# EAGLE design NQSMHS (EAGLE 5.10)

## Sheet 1 of 4
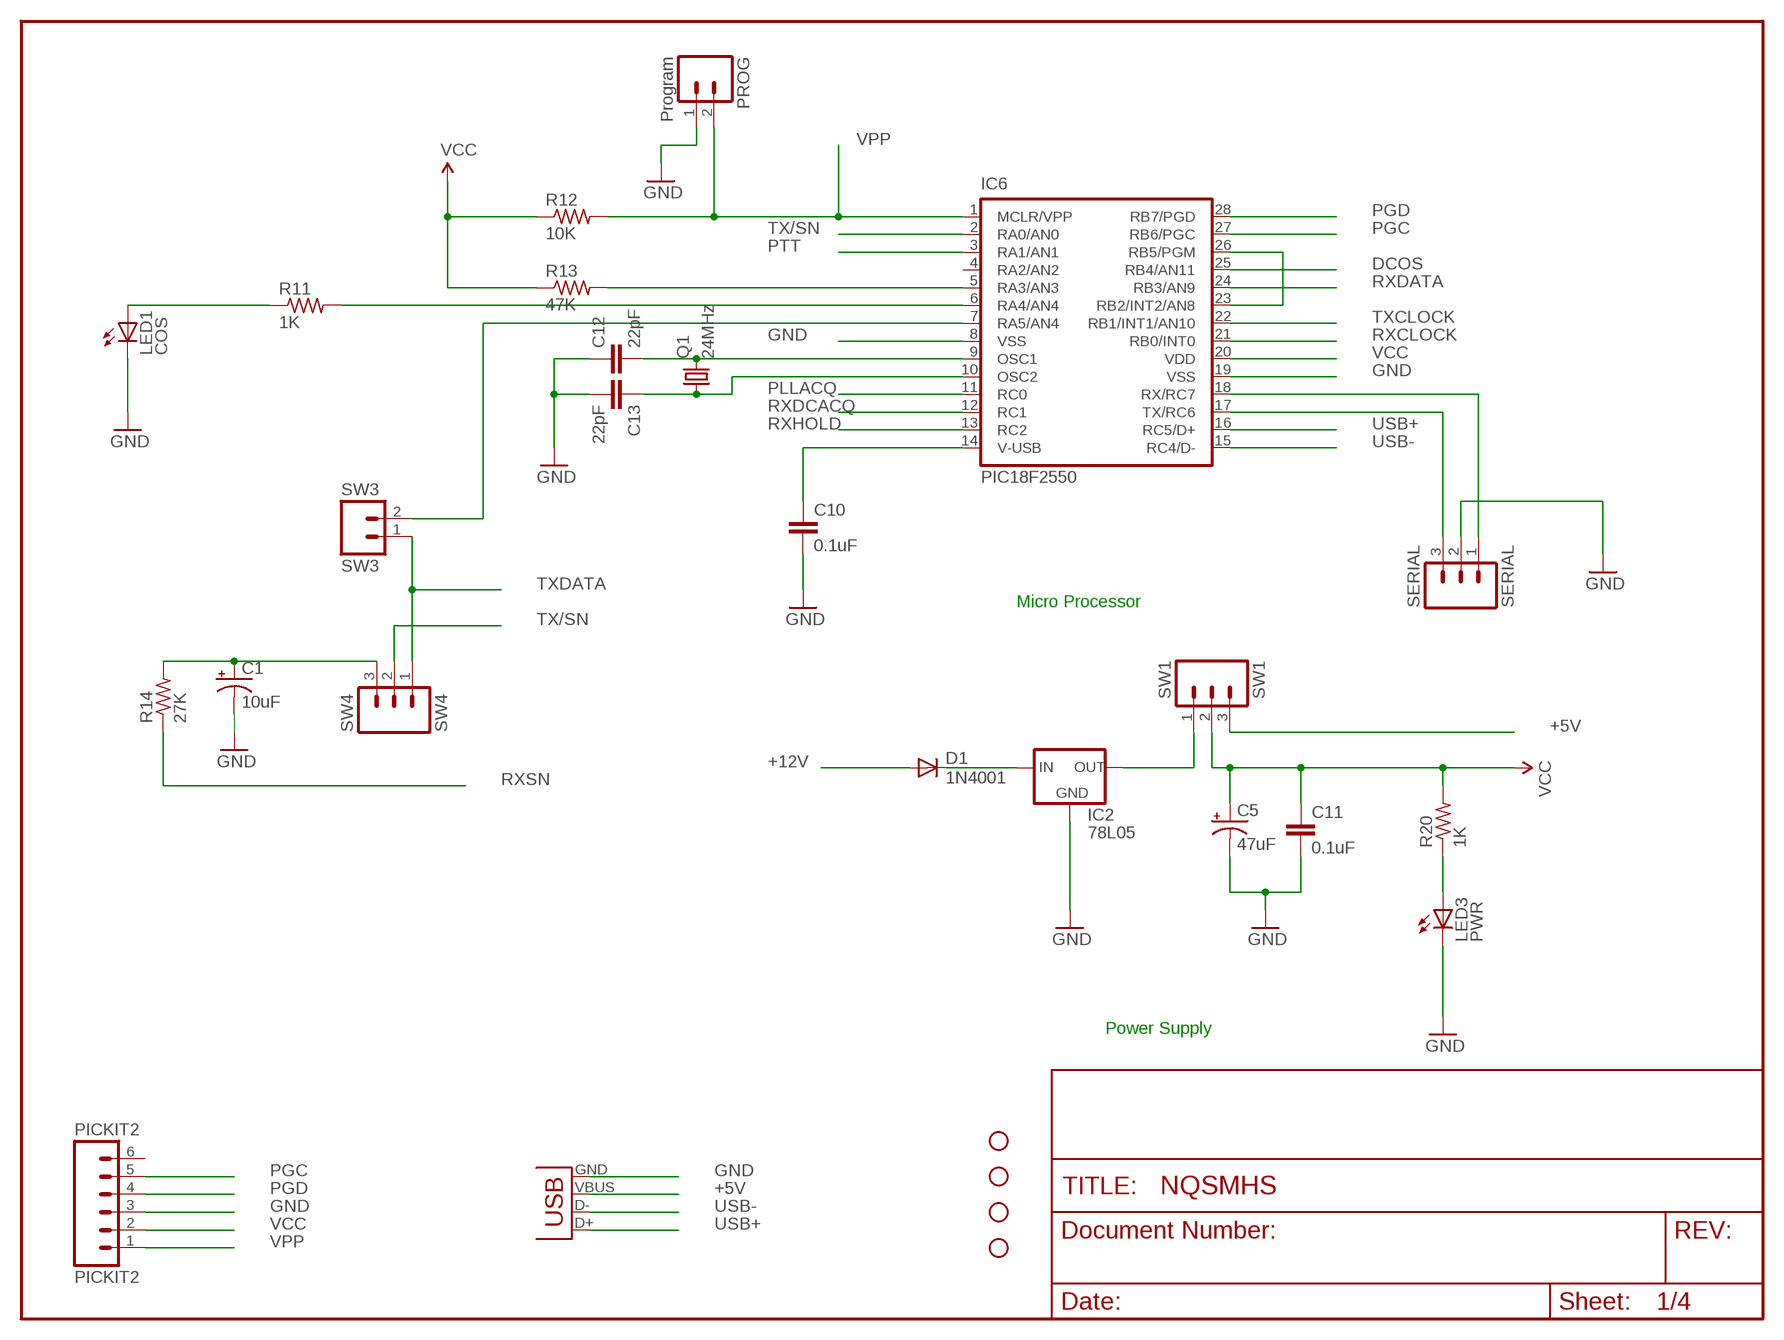
[diagram p0: schematic, sheet 1]

### Parts
C1  10uF  CAP_POLPTH2  [CPOL-RADIAL-10UF-25V]
C5  47uF  CAP_POLPTH2  [CPOL-RADIAL-10UF-25V]
C10  0.1uF  C2.5/2  [C2.5-2]
C11  0.1uF  C2.5/2  [C2.5-2]
C12  22pF  C2.5/2  [C2.5-2]
C13  22pF  C2.5/2  [C2.5-2]
D1  1N4001  DIODEPTH  [DIODE-1N4001]
IC2  78L05  78LXX  [78LXX]
IC6  PIC18F2550  [DIL28-3]
J1  USBPTH  [USB-B-PTH]
JP7  STAND-OFF  [STAND-OFF]
JP8  STAND-OFF  [STAND-OFF]
JP9  STAND-OFF  [STAND-OFF]
JP10  STAND-OFF  [STAND-OFF]
LED1  COS  LED5MM  [LED5MM]
LED3  PWR  LED5MM  [LED5MM]
PICKIT2  PICKIT2  M06SIP  [1X06]
PROG  Program  M02PTH  [1X02]
Q1  24MHz  CRYSTALHC49US  [HC49US]
R11  1K  R-US_0207/2V  [0207/2V]
R12  10K  R-US_0207/2V  [0207/2V]
R13  47K  R-US_0207/2V  [0207/2V]
R14  27K  R-US_0207/2V  [0207/2V]
R20  1K  R-US_0207/2V  [0207/2V]
SERIAL  SERIAL  M03PTH  [1X03]
SW1  SW1  M03PTH  [1X03]
SW3  SW3  M02PTH  [1X02]
SW4  SW4  M03PTH  [1X03]

### Nets
+5V: J1.VBUS SW1.3
+12V: D1.A ; also sheet 2
DCOS: IC6.25(RB4/AN11) ; also sheet 3
GND: C1.2(-) C5.2(-) C10.2 C11.2 C12.1 C13.2 IC2.GND IC6.8(VSS) IC6.19(VSS) J1.GND LED1.K(C) LED3.K(C) PICKIT2.3 PROG.1 SERIAL.2 ; also sheet 2,3,4
N$2: D1.C IC2.IN
N$3: IC6.23(RB2/INT2/AN8) IC6.26(RB5/PGM)
N$4: IC6.5(RA3/AN3) R13.2
N$5: IC6.6(RA4/AN4) R11.2
N$6: LED1.A R11.1
N$7: IC6.7(RA5/AN4) SW3.2
N$8: C1.1(+) R14.2 SW4.3
N$9: C12.2 IC6.9(OSC1) Q1.2
N$10: C13.1 IC6.10(OSC2) Q1.1
N$11: C10.1 IC6.14(V-USB)
N$12: IC2.OUT SW1.1
N$13: LED3.A R20.1
PGC: IC6.27(RB6/PGC) PICKIT2.5
PGD: IC6.28(RB7/PGD) PICKIT2.4
PLLACQ: IC6.11(RC0) ; also sheet 4
PTT: IC6.3(RA1/AN1) ; also sheet 2
RX-232: IC6.18(RX/RC7) SERIAL.1
RXCLOCK: IC6.21(RB0/INT0) ; also sheet 4
RXDATA: IC6.24(RB3/AN9) ; also sheet 4
RXDCACQ: IC6.12(RC1) ; also sheet 4
RXHOLD: IC6.13(RC2) ; also sheet 4
RXSN: R14.1 ; also sheet 3,4
TX-232: IC6.17(TX/RC6) SERIAL.3
TX/SN: IC6.2(RA0/AN0) SW4.2
TXCLOCK: IC6.22(RB1/INT1/AN10) ; also sheet 4
TXDATA: SW3.1 SW4.1 ; also sheet 4
USB+: IC6.16(RC5/D+) J1.D+
USB-: IC6.15(RC4/D-) J1.D-
VCC: C5.1(+) C11.1 IC6.20(VDD) PICKIT2.2 R12.1 R13.1 R20.2 SW1.2 ; also sheet 2,3,4
VPP: IC6.1(MCLR/VPP) PICKIT2.1 PROG.2 R12.2
Unconnected: IC6.4(RA2/AN2) PICKIT2.6

### Notes on the sheet
- Micro Processor
- Power Supply

## Sheet 2 of 4
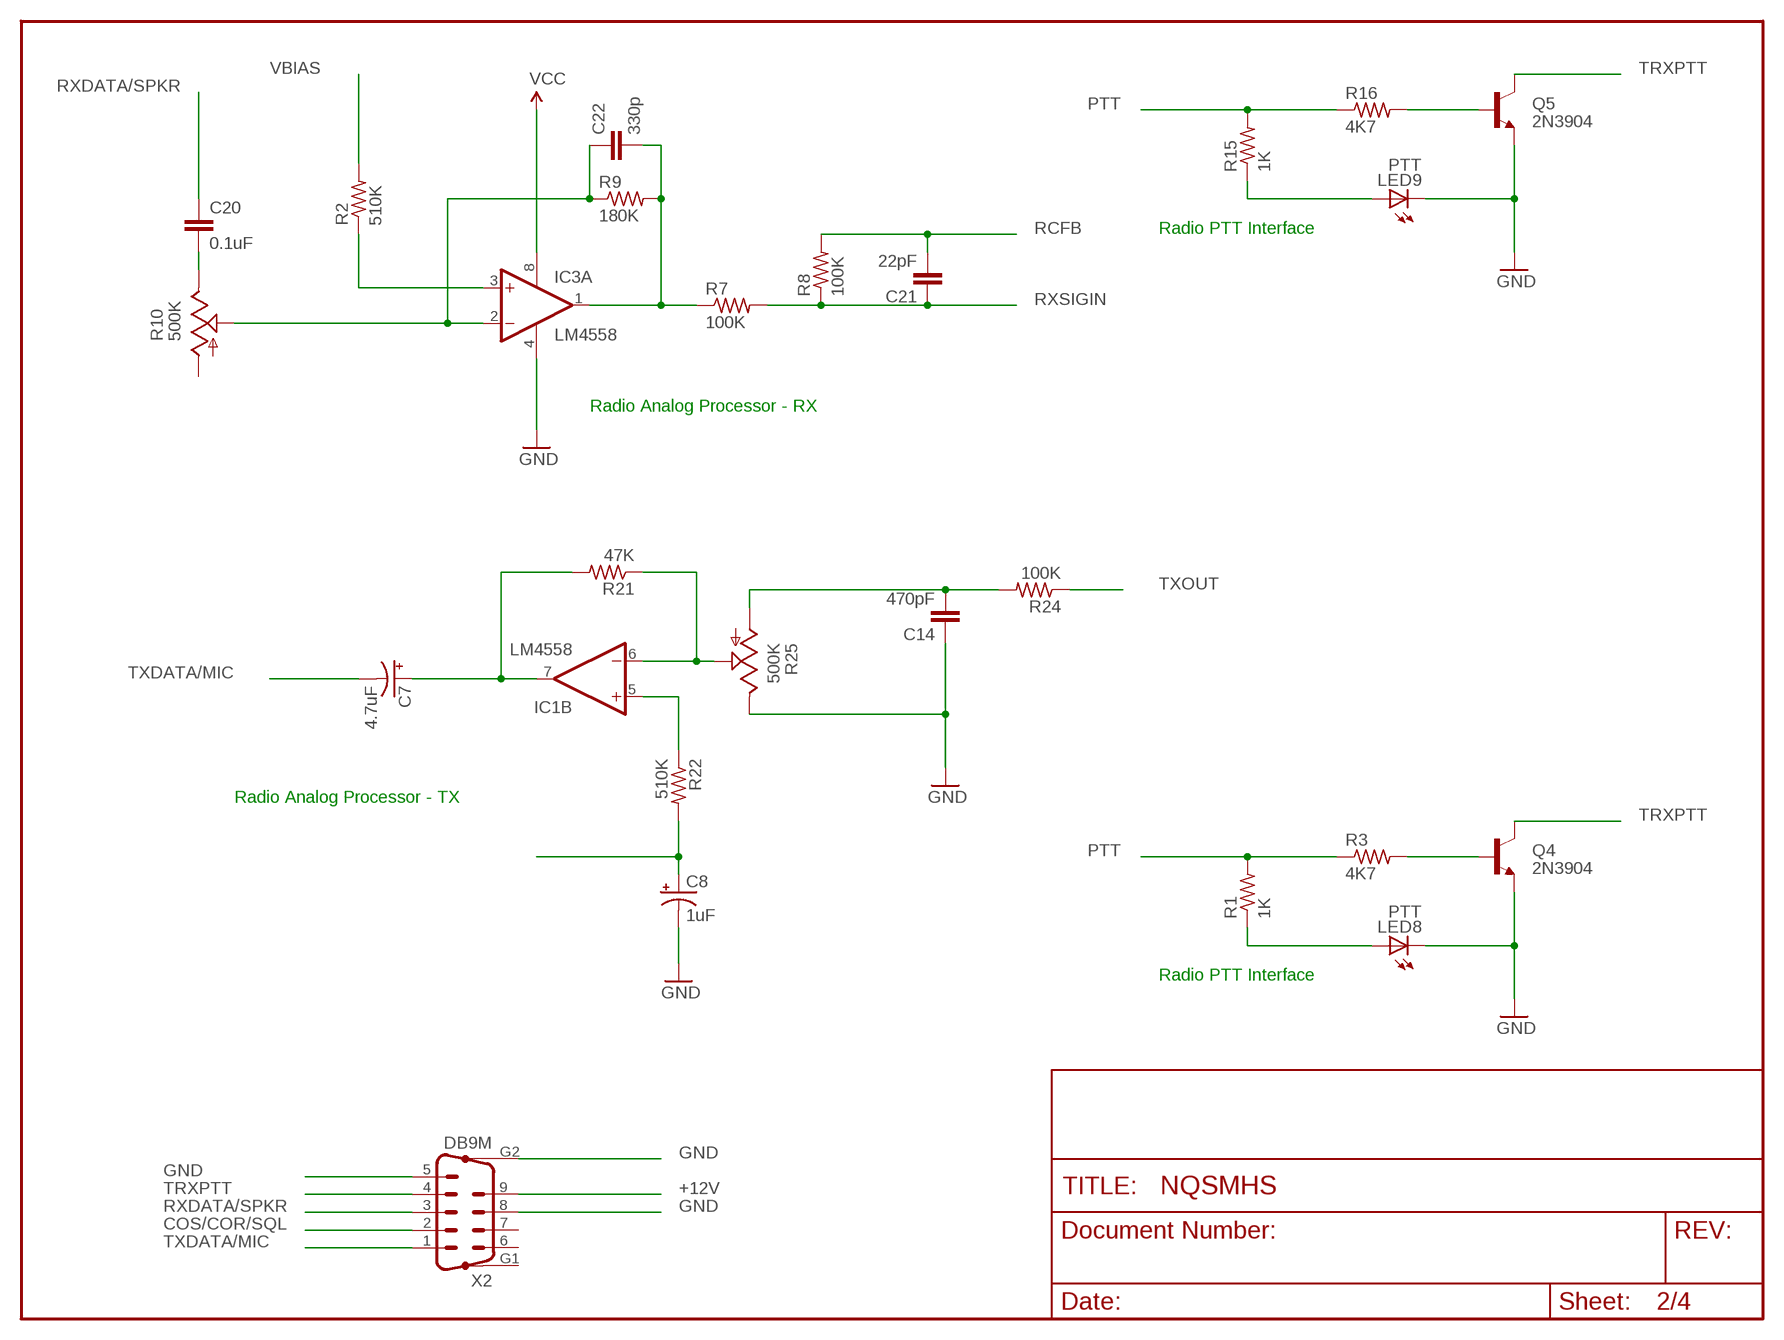
[diagram p1: schematic, sheet 2]

### Parts
C7  4.7uF  CAP_POLPTH2  [CPOL-RADIAL-10UF-25V]
C8  1uF  CAP_POLPTH2  [CPOL-RADIAL-10UF-25V]
C14  470pF  C2.5/2  [C2.5-2]
C20  0.1uF  C2.5/2  [C2.5-2]
C21  22pF  C2.5/2  [C2.5-2]
C22  330p  C2.5/2  [C2.5-2]
IC1  LM4558  OPA2344P  [DIL08]
IC3  LM4558  OPA2344P  [DIL08]
LED8  PTT  LED5MM  [LED5MM]
LED9  PTT  LED5MM  [LED5MM]
Q4  2N3904  TRANSISTOR_NPNTO92  [TO-92]
Q5  2N3904  TRANSISTOR_NPNTO92  [TO-92]
R1  1K  R-US_0207/2V  [0207/2V]
R2  510K  R-US_0207/2V  [0207/2V]
R3  4K7  R-US_0207/2V  [0207/2V]
R7  100K  R-US_0207/2V  [0207/2V]
R8  100K  R-US_0207/2V  [0207/2V]
R9  180K  R-US_0207/2V  [0207/2V]
R10  500K  TRIM_US-CA6V  [CA6V]
R15  1K  R-US_0207/2V  [0207/2V]
R16  4K7  R-US_0207/2V  [0207/2V]
R21  47K  R-US_0207/2V  [0207/2V]
R22  510K  R-US_0207/2V  [0207/2V]
R24  100K  R-US_0207/2V  [0207/2V]
R25  500K  TRIM_US-CA6V  [CA6V]
X2  DB9M  M09HP  [M09HP]

### Nets
+12V: X2.9 ; also sheet 1
COS/COR/SQL: X2.2
GND: C8.2(-) C14.1 IC3.4(A:V-) LED8.K(C) LED9.K(C) Q4.1(E) Q5.1(E) R25.E X2.5 X2.8 X2.G2 ; also sheet 1,3,4
N$15: Q4.2(B) R3.2
N$17: LED8.A R1.1
N$18: Q5.2(B) R16.2
N$19: C7.1(+) IC1.7(B:OUT) R21.2
N$20: LED9.A R15.1
N$23: C22.2 IC3.1(A:OUT) R7.1 R9.2
N$25: IC1.5(B:+IN) R22.1
N$26: C22.1 IC3.2(A:-IN) R9.1 R10.S
N$27: C14.2 R24.2 R25.A
N$28: IC1.6(B:-IN) R21.1 R25.S
N$37: C20.2 R10.E
N$40: IC3.3(A:+IN) R2.1
PTT: R1.2 R3.1 R15.2 R16.1 ; also sheet 1
RCFB: C21.2 R8.2 ; also sheet 4
RXDATA/SPKR: C20.1 X2.3
RXSIGIN: C21.1 R7.2 R8.1 ; also sheet 4
TRXPTT: Q4.3(C) Q5.3(C) X2.4
TXDATA/MIC: C7.2(-) X2.1
TXOUT: R24.1 ; also sheet 4
VBIAS: C8.1(+) R2.2 R22.2 ; also sheet 4
VCC: IC3.8(A:V+) ; also sheet 1,3,4
Unconnected: IC1.1(A:OUT) IC1.2(A:-IN) IC1.3(A:+IN) IC3.5(B:+IN) IC3.6(B:-IN) IC3.7(B:OUT) R10.A X2.6 X2.7 X2.G1

### Notes on the sheet
- Radio PTT Interface
- Radio Analog Processor - RX
- Radio Analog Processor - TX
- Radio PTT Interface

## Sheet 3 of 4
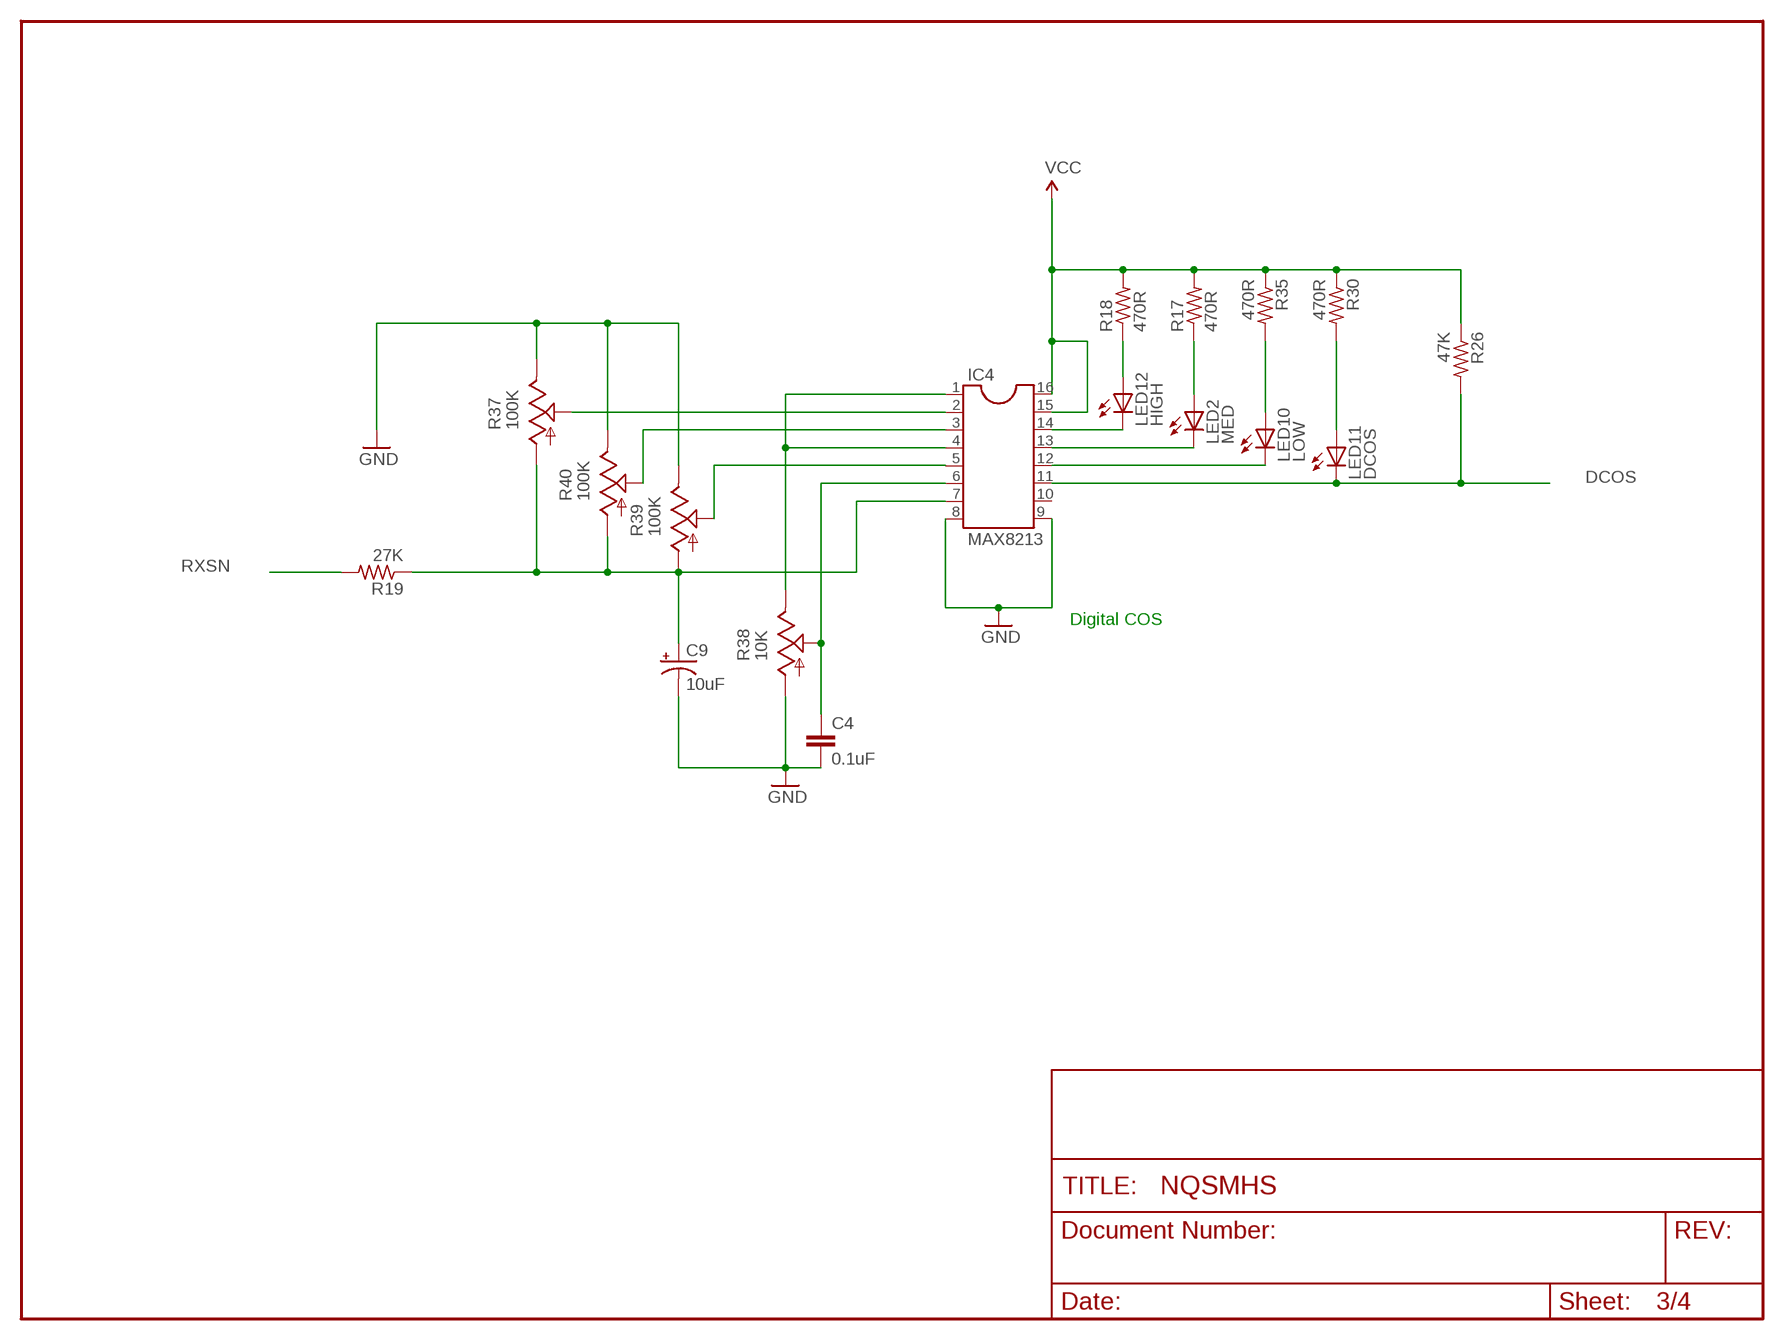
[diagram p2: schematic, sheet 3]

### Parts
C4  0.1uF  C2.5/2  [C2.5-2]
C9  10uF  CAP_POLPTH2  [CPOL-RADIAL-10UF-25V]
IC4  MAX8213  DIL16  [DIL16]
LED2  MED  LED5MM  [LED5MM]
LED10  LOW  LED5MM  [LED5MM]
LED11  DCOS  LED5MM  [LED5MM]
LED12  HIGH  LED5MM  [LED5MM]
R17  470R  R-US_0207/2V  [0207/2V]
R18  470R  R-US_0207/2V  [0207/2V]
R19  27K  R-US_0207/2V  [0207/2V]
R26  47K  R-US_0207/2V  [0207/2V]
R30  470R  R-US_0207/2V  [0207/2V]
R35  470R  R-US_0207/2V  [0207/2V]
R37  100K  TRIM_US-CA6V  [CA6V]
R38  10K  TRIM_US-CA6V  [CA6V]
R39  100K  TRIM_US-CA6V  [CA6V]
R40  100K  TRIM_US-CA6V  [CA6V]

### Nets
DCOS: IC4.11 LED11.K(C) R26.2 ; also sheet 1
GND: C4.2 C9.2(-) IC4.8 IC4.9 R37.E R38.A R39.E R40.E ; also sheet 1,2,4
N$14: C4.1 IC4.6 R38.S
N$16: IC4.14 LED12.K(C)
N$41: LED12.A R18.1
N$44: IC4.13 LED2.K(C)
N$45: LED2.A R17.1
N$46: IC4.12 LED10.K(C)
N$47: LED11.A R30.2
N$48: LED10.A R35.2
N$49: IC4.2 R37.S
N$50: IC4.3 R40.S
N$51: IC4.5 R39.S
N$52: IC4.1 IC4.4 R38.E
N$53: C9.1(+) IC4.7 R19.1 R37.A R39.A R40.A
RXSN: R19.2 ; also sheet 1,4
VCC: IC4.15 IC4.16 R17.2 R18.2 R26.1 R30.1 R35.1 ; also sheet 1,2,4
Unconnected: IC4.10

### Notes on the sheet
- Digital COS

## Sheet 4 of 4
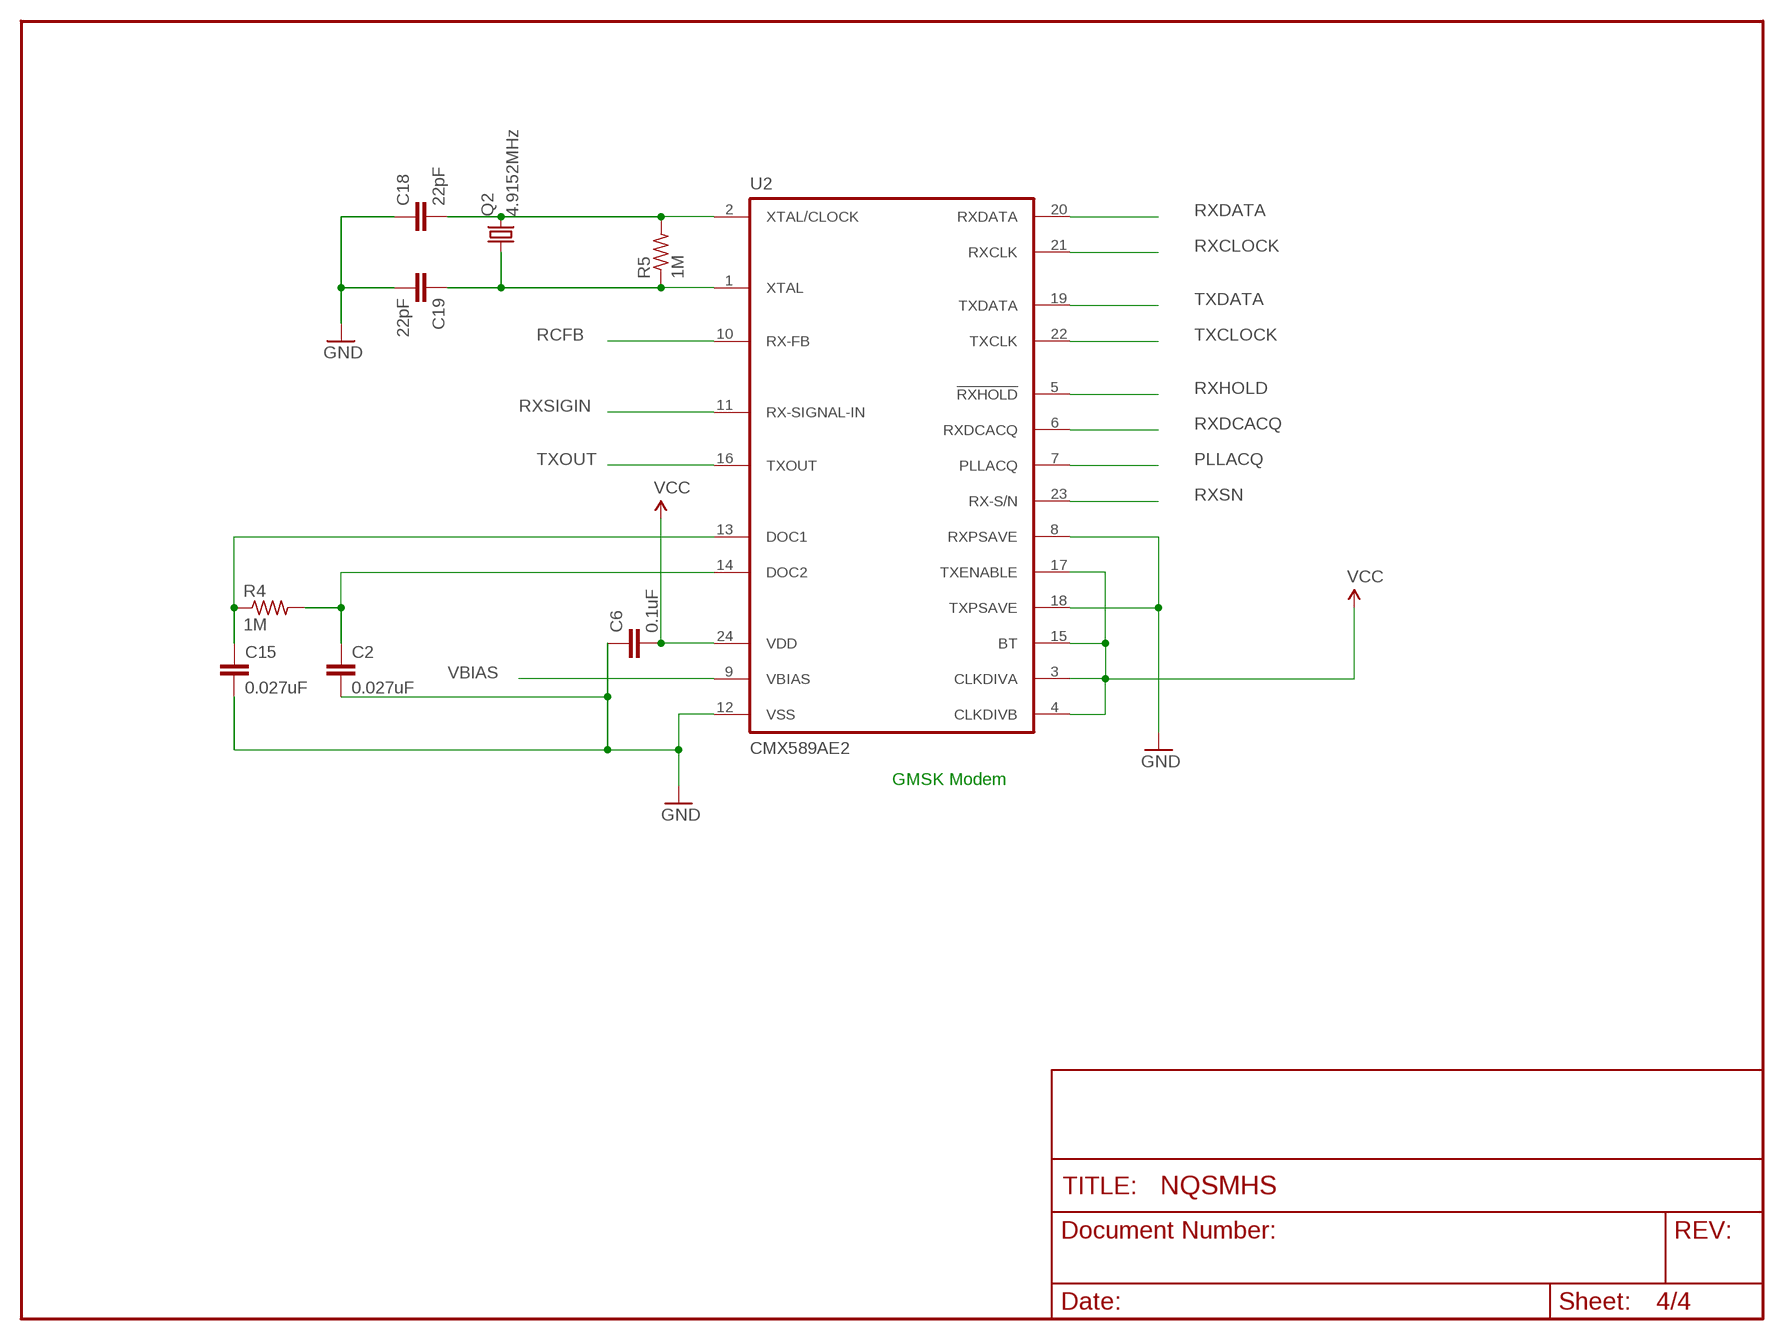
[diagram p3: schematic, sheet 4]

### Parts
C2  0.027uF  C2.5/2  [C2.5-2]
C6  0.1uF  C2.5/2  [C2.5-2]
C15  0.027uF  C2.5/2  [C2.5-2]
C18  22pF  C2.5/2  [C2.5-2]
C19  22pF  C2.5/2  [C2.5-2]
Q2  4.9152MHz  CRYSTALHC49US  [HC49US]
R4  1M  R-US_0207/2V  [0207/2V]
R5  1M  R-US_0207/2V  [0207/2V]
U2  CMX589AE2  [TSSOP24]

### Nets
GND: C2.2 C6.1 C15.2 C18.1 C19.2 U2.8(RXPSAVE) U2.12(VSS) U2.18(TXPSAVE) ; also sheet 1,2,3
N$1: C15.1 R4.1 U2.13(DOC1)
N$21: C2.1 R4.2 U2.14(DOC2)
N$22: C19.1 Q2.1 R5.1 U2.1(XTAL)
N$24: C18.2 Q2.2 R5.2 U2.2(XTAL/CLOCK)
PLLACQ: U2.7(PLLACQ) ; also sheet 1
RCFB: U2.10(RX-FB) ; also sheet 2
RXCLOCK: U2.21(RXCLK) ; also sheet 1
RXDATA: U2.20(RXDATA) ; also sheet 1
RXDCACQ: U2.6(RXDCACQ) ; also sheet 1
RXHOLD: U2.5(!RXHOLD!) ; also sheet 1
RXSIGIN: U2.11(RX-SIGNAL-IN) ; also sheet 2
RXSN: U2.23(RX-S/N) ; also sheet 1,3
TXCLOCK: U2.22(TXCLK) ; also sheet 1
TXDATA: U2.19(TXDATA) ; also sheet 1
TXOUT: U2.16(TXOUT) ; also sheet 2
VBIAS: U2.9(VBIAS) ; also sheet 2
VCC: C6.2 U2.3(CLKDIVA) U2.4(CLKDIVB) U2.15(BT) U2.17(TXENABLE) U2.24(VDD) ; also sheet 1,2,3

### Notes on the sheet
- GMSK Modem

## Power pins joined to a net without a drawn wire
V+: IC1.8(A:V+)
V-: IC1.4(A:V-)

## Library data of the parts
C1 C5 C7-C9 = SparkFun:CAP_POL: Capacitor Polarized These are standard SMD and PTH capacitors. Normally 10uF, 47uF, and 100uF in electrolytic and tantalum varieties. Always verify the external diameter of the through hole cap, it varies with capacity, voltage, and manufacturer. The EIA devices should be standard.
C2 C4 C6 C10-C15 C18-C22 = capacitor-wima:C: CAPACITOR naming: grid - package width
D1 = SparkFun:DIODE: Diode These are standard reverse protection diodes and small signal diodes. SMA package can handle up to about 1A. SOD-323 can handle about 200mA. What the SOD-323 package when ordering, there are some mfgs out there that are 5-pin packages.
IC1 IC3 = linear:OPA2*: Dual Operational Amplifier Low Power, Single-Supply, Rail-To-Rail Operational Amplifier Source: http://focus.ti.com/lit/ds/symlink/opa2345.pdf http://focus.ti.com .. opa241.pdf http://focus.ti.com/lit/ds/symlink/opa2134.pdf
IC2 = v-reg:78LXX: VOLTAGE REGULATOR
IC4 = ic-package:DIL16: Dual In Line / Socket
IC6 = SparkFun:PIC18F2550
J1 = SparkFun:USB: USB Connectors USB-B-PTH is fully proven SKU : PRT-00139 USB-miniB is fully proven SKU : PRT-00587 USB-A-PCB is untested. USB-A-H is throughly reviewed, but untested. Spark Fun Electronics SKU : PRT-00437 USB-B-SMT is throughly reviewed, but untested. Needs silkscreen touching up. USB-A-S has not been used/tested USB-MB-H has not been used/tested
JP7-JP10 = SparkFun:STAND-OFF: Stand Off This is the mechanical footprint for a #4 phillips button head screw. Use the keepout ring to avoid running the screw head into surrounding components. SKU : PRT-00447
LED1-LED3 LED8-LED12 = SparkFun:LED: LEDs Standard schematic elements and footprints for 5mm, 3mm, 1206, and 0603 sized LEDs. 5mm - Spark Fun Electronics SKU : COM-00529 (and others)
PICKIT2 = SparkFun:M06: Header 6 Standard 6-pin 0.1" header. Use with straight break away headers (SKU : PRT-00116), right angle break away headers (PRT-00553), swiss pins (PRT-00743), machine pins (PRT-00117), and female headers (PRT-00115). Molex polarized connector foot print use with SKU : PRT-08094 with associated crimp pins and housings. NOTES ON THE VARIANTS LOCK and LOCK_LONGPADS... This footprint was designed to help hold the alignment of a through-hole component (i.e. 6-pin header) while soldering it into place. You may notice that each hole has been shifted either up or down by 0.005 of an inch from it's more standard position (which is a perfectly straight line). This slight alteration caused the pins (the squares in the middle) to touch the edges of the holes. Because they are alternating, it causes a "brace" to hold the component in place. 0.005 has proven to be the perfect amount of "off-center" position when using our standard breakaway headers. Although looks a little odd when you look at the bare footprint, once you have a header in there, the alteration is very hard to notice. Also, if you push a header all the way into place, it is covered up entirely on the bottom side. This idea of altering the position of holes to aid alignment will be further integrated into the Sparkfun Library for other footprints. It can help hold any component with 3 or more connection pins.
PROG SW3 = SparkFun:M02: Header 2 Standard 2-pin 0.1" header. Use with straight break away headers (SKU : PRT-00116), right angle break away headers (PRT-00553), swiss pins (PRT-00743), machine pins (PRT-00117), and female headers (PRT-00115). Molex polarized connector foot print use with SKU : PRT-08233 with associated crimp pins and housings.
Q1 Q2 = SparkFun:CRYSTAL: Crystals Various standard crystals. Proven footprints. Spark Fun Electronics SKU : COM-00534
Q4 Q5 = SparkFun:TRANSISTOR_NPN: Transistor NPN BJT configuration in SOT23 package. MMBT2222 is the common NPN we use. Double check BCE configuration again layout.
R1-R5 R7-R9 R11-R22 R24 R26 R30 R35 = resistor:R-US_: RESISTOR, American symbol
R10 R25 R37-R40 = pot:TRIM_US-: POTENTIOMETER
SERIAL SW1 SW4 = SparkFun:M03: Header 3 Standard 3-pin 0.1" header. Use with straight break away headers (SKU : PRT-00116), right angle break away headers (PRT-00553), swiss pins (PRT-00743), machine pins (PRT-00117), and female headers (PRT-00115). Molex polarized connector foot print use with SKU : PRT-08232 with associated crimp pins and housings.
U2 = cml-micro:CMX589A: HIGH-SPEED GMSK MODEM
X2 = con-subd:M09HP: SUB-D

## Board
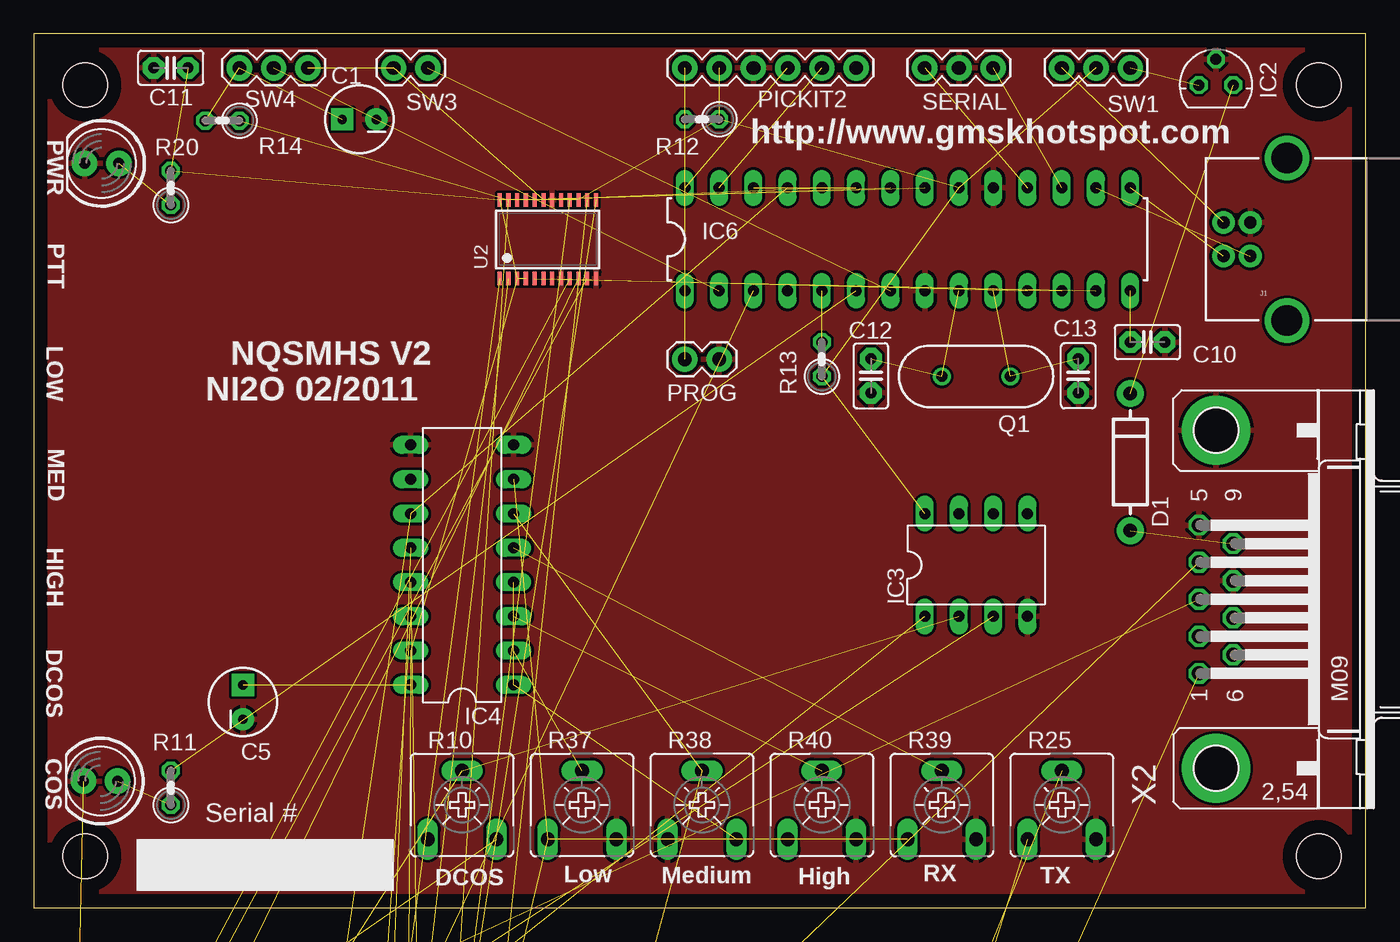
[diagram p4: board, top side]
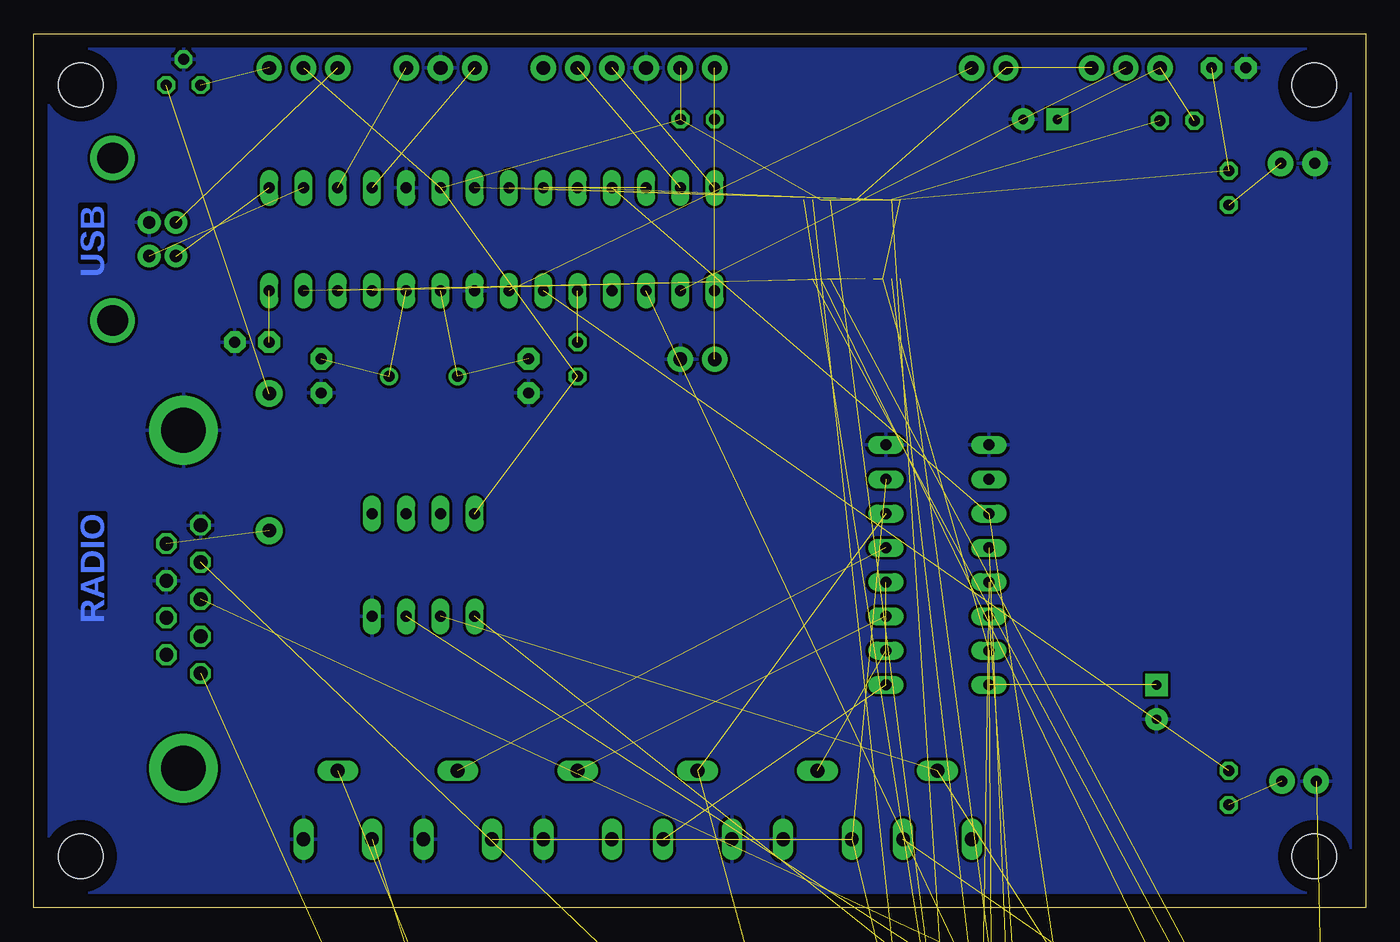
[diagram p5: board, bottom side, seen from below]

Size 98.73 x 64.76 mm. Coordinates in mm from the lower left corner, seen from the top.
Outline: 98.73,0 98.73,64.76 0,64.76 0,0 98.73,0
Copper layers (1*16): Top 0.035mm / dielectric 1.5mm / Bottom 0.035mm
Design rules "default": minimum track width 10mil, minimum drill 24mil, track to track 8mil, track to pad 8mil, pad to pad 8mil, via to via 8mil, smd to smd 8mil, copper to edge 40mil, drill to drill 8mil, minimum pad ring 10mil, minimum via ring 8mil, stop-mask expansion 4mil, vias tented up to drill 0mil, thermal gap 10mil

### Footprints (pad centres in the part's own frame; a part is rotated, then mirrored left to right if it is on the bottom)
CPOL-RADIAL-10UF-25V = drill 0.7 pad 1.651 square: 1 1.27,0 | drill 0.7 pad 1.651 round: 2 -1.27,0
C2.5-2 = drill 0.813 pad 1.6 octagon: 1 -1.27,0; 2 1.27,0
DIODE-1N4001 = drill 1 pad 1.981 round: A -5.08,0; C 5.08,0
DIL08 = drill 0.813 long: 1 -3.81,-3.81; 2 -1.27,-3.81; 3 1.27,-3.81; 4 3.81,-3.81; 5 3.81,3.81; 6 1.27,3.81; 7 -1.27,3.81; 8 -3.81,3.81
78LXX = drill 0.813 octagon: GND 0,1.905; IN 1.27,0; OUT -1.27,0
DIL16 = drill 0.813 long: 1 -8.89,-3.81; 2 -6.35,-3.81; 3 -3.81,-3.81; 4 -1.27,-3.81; 5 1.27,-3.81; 6 3.81,-3.81; 7 6.35,-3.81; 8 8.89,-3.81; 9 8.89,3.81; 10 6.35,3.81; 11 3.81,3.81; 12 1.27,3.81; 13 -1.27,3.81; 14 -3.81,3.81; 15 -6.35,3.81; 16 -8.89,3.81
DIL28-3 = drill 0.813 long: 1 -16.51,-3.81; 2 -13.97,-3.81; 3 -11.43,-3.81; 4 -8.89,-3.81; 5 -6.35,-3.81; 6 -3.81,-3.81; 7 -1.27,-3.81; 8 1.27,-3.81; 9 3.81,-3.81; 10 6.35,-3.81; 11 8.89,-3.81; 12 11.43,-3.81; 13 13.97,-3.81; 14 16.51,-3.81; 15 16.51,3.81; 16 13.97,3.81; 17 11.43,3.81; 18 8.89,3.81; 19 6.35,3.81; 20 3.81,3.81; 21 1.27,3.81; 22 -1.27,3.81; 23 -3.81,3.81; 24 -6.35,3.81; 25 -8.89,3.81; 26 -11.43,3.81; 27 -13.97,3.81; 28 -16.51,3.81
USB-B-PTH = drill 0.914 pad 1.676 round: D+ 0,1.25; D- 1.981,1.25; GND 0,-1.25; VBUS 1.981,-1.25 | drill 2.286 round: P$1 -2.718,-6.02; P$2 -2.718,6.02
STAND-OFF = hole 3.302: 0,0
LED5MM = drill 0.813 pad 1.88 round: A -1.27,0; K 1.27,0
1X06 = drill 1.016 pad 1.88 round: 1 0,0; 2 2.54,0; 3 5.08,0; 4 7.62,0; 5 10.16,0; 6 12.7,0
1X02 = drill 1.016 pad 1.88 round: 1 0,0; 2 2.54,0
HC49US = drill 0.813 round: 1 -2.54,0; 2 2.54,0
TO-92 = drill 0.813 pad 1.88 round: 1 -1.27,0; 2 0,1.905; 3 1.27,0
0207/2V = drill 0.813 octagon: 1 -1.27,0; 2 1.27,0
CA6V = drill 1.016 long: A -2.54,-2.54; E 2.54,-2.54; S 0,2.54
1X03 = drill 1.016 pad 1.88 round: 1 0,0; 2 2.54,0; 3 5.08,0
TSSOP24 = smd 0.305 x 0.991: 1 -3.575,-2.918; 2 -2.925,-2.918; 3 -2.275,-2.918; 4 -1.625,-2.918; 5 -0.975,-2.918; 6 -0.325,-2.918; 7 0.325,-2.918; 8 0.975,-2.918; 9 1.625,-2.918; 10 2.275,-2.918; 11 2.925,-2.918; 12 3.575,-2.918; 13 3.575,2.918; 14 2.925,2.918; 15 2.275,2.918; 16 1.625,2.918; 17 0.975,2.918; 18 0.325,2.918; 19 -0.325,2.918; 20 -0.975,2.918; 21 -1.625,2.918; 22 -2.275,2.918; 23 -2.925,2.918; 24 -3.575,2.918
M09HP = drill 1.016 octagon: 1 -5.486,1.27; 2 -2.743,1.27; 3 0,1.27; 4 2.743,1.27; 5 5.486,1.27; 6 -4.115,-1.27; 7 -1.372,-1.27; 8 1.372,-1.27; 9 4.115,-1.27 | drill 3.302 pad 5.08 round: G1 -12.522,0; G2 12.522,0

### Placement (x,y rotation side)
C1  24.13,58.42 180 top
C2  13.97,-212.09 0 top  (outside the outline)
C4  7.62,-148.59 0 top  (outside the outline)
C5  15.51,15.24 90 top
C6  10.16,-220.98 0 top  (outside the outline)
C7  0,-177.8 0 top  (outside the outline)
C8  7.62,-177.8 0 top  (outside the outline)
C9  0,-148.59 0 top  (outside the outline)
C10  82.55,41.91 0 top
C11  10.16,62.23 180 top
C12  62.05,39.41 90 top
C13  77.42,39.41 270 top
C14  15.24,-177.8 0 top  (outside the outline)
C15  0,-220.98 0 top  (outside the outline)
C18  17.78,-220.98 0 top  (outside the outline)
C19  0,-228.6 0 top  (outside the outline)
C20  0,-17.78 0 top  (outside the outline)
C21  7.62,-17.78 0 top  (outside the outline)
C22  15.24,-17.78 0 top  (outside the outline)
D1  81.28,33.02 90 top
IC1  3.81,-167.64 0 top  (outside the outline)
IC2  87.63,60.96 0 top
IC3  69.85,25.4 0 top
IC4  31.75,25.4 90 top
IC6  64.77,49.53 0 top
J1  90.17,49.53 180 top
JP7  3.81,3.81 0 top
JP8  95.25,3.81 0 top
JP9  3.81,60.96 0 top
JP10  95.25,60.96 0 top
LED1  4.94,9.39 180 top
LED2  29.21,-140.97 0 top  (outside the outline)
LED3  5.03,55.16 180 top
LED8  1.27,-40.64 0 top  (outside the outline)
LED9  1.27,-62.23 0 top  (outside the outline)
LED10  20.32,-127 0 top  (outside the outline)
LED11  1.27,-140.97 0 top  (outside the outline)
LED12  15.24,-140.97 0 top  (outside the outline)
PICKIT2  48.26,62.23 0 top
PROG  50.8,40.64 180 top
Q1  69.85,39.37 180 top
Q2  3.81,-203.2 0 top  (outside the outline)
Q4  0,-55.88 0 top  (outside the outline)
Q5  0,-77.47 0 top  (outside the outline)
R1  7.62,-48.26 0 top  (outside the outline)
R2  0,-25.4 0 top  (outside the outline)
R3  0,-48.26 0 top  (outside the outline)
R4  7.62,-228.6 0 top  (outside the outline)
R5  15.24,-228.6 0 top  (outside the outline)
R7  10.16,-25.4 0 top  (outside the outline)
R8  0,-33.02 0 top  (outside the outline)
R9  10.16,-33.02 0 top  (outside the outline)
R10  31.75,7.62 0 top
R11  10.16,8.89 90 top
R12  49.53,58.42 180 top
R13  58.42,40.64 90 top
R14  13.99,58.32 180 top
R15  0,-69.85 0 top  (outside the outline)
R16  7.62,-69.85 0 top  (outside the outline)
R17  15.24,-148.59 0 top  (outside the outline)
R18  25.4,-148.59 0 top  (outside the outline)
R19  20.32,-157.48 0 top  (outside the outline)
R20  10.16,53.34 90 top
R21  0,-194.31 0 top  (outside the outline)
R22  0,-186.69 0 top  (outside the outline)
R24  10.16,-186.69 0 top  (outside the outline)
R25  76.2,7.62 0 top
R26  27.94,-157.48 0 top  (outside the outline)
R30  0,-157.48 0 top  (outside the outline)
R35  10.16,-157.48 0 top  (outside the outline)
R37  40.64,7.62 0 top
R38  49.53,7.62 0 top
R39  67.31,7.62 0 top
R40  58.42,7.62 0 top
SERIAL  66.04,62.23 0 top
SW1  81.28,62.23 180 top
SW3  26.67,62.23 0 top
SW4  20.32,62.23 180 top
U2  38.1,49.53 0 top
X2  87.63,22.86 90 top

### Tracks (layer width: path | path; a pad name or v marks a point on that pad's centre or on a via)
+5V  (1 unrouted)
+12V  (1 unrouted)
DCOS  (3 unrouted)
GND  (13 unrouted)
  pour Bottom: 0,64.77 99.06,64.77 99.06,0 0,0
  pour Top: 0,-0.23 98.65,-0.23 98.65,64.85 0,64.85
N$1  (2 unrouted)
N$2  (1 unrouted)
N$3  (1 unrouted)
N$4  (1 unrouted)
N$5  (1 unrouted)
N$6  (1 unrouted)
N$7  (1 unrouted)
N$8  (2 unrouted)
N$9  (2 unrouted)
N$10  (2 unrouted)
N$11  (1 unrouted)
N$12  (1 unrouted)
N$13  (1 unrouted)
N$14  (2 unrouted)
N$15  (1 unrouted)
N$16  (1 unrouted)
N$17  (1 unrouted)
N$18  (1 unrouted)
N$19  (2 unrouted)
N$20  (1 unrouted)
N$21  (2 unrouted)
N$22  (3 unrouted)
N$23  (3 unrouted)
N$24  (3 unrouted)
N$25  (1 unrouted)
N$26  (3 unrouted)
N$27  (2 unrouted)
N$28  (2 unrouted)
N$37  (1 unrouted)
N$40  (1 unrouted)
N$41  (1 unrouted)
N$44  (1 unrouted)
N$45  (1 unrouted)
N$46  (1 unrouted)
N$47  (1 unrouted)
N$48  (1 unrouted)
N$49  (1 unrouted)
N$50  (1 unrouted)
N$51  (1 unrouted)
N$52  (2 unrouted)
N$53  (5 unrouted)
PGC  (1 unrouted)
PGD  (1 unrouted)
PLLACQ  (1 unrouted)
PTT  (4 unrouted)
RCFB  (2 unrouted)
RX-232  (1 unrouted)
RXCLOCK  (1 unrouted)
RXDATA  (1 unrouted)
RXDATA/SPKR  (1 unrouted)
RXDCACQ  (1 unrouted)
RXHOLD  (1 unrouted)
RXSIGIN  (3 unrouted)
RXSN  (2 unrouted)
TRXPTT  (2 unrouted)
TX-232  (1 unrouted)
TX/SN  (1 unrouted)
TXCLOCK  (1 unrouted)
TXDATA  (2 unrouted)
TXDATA/MIC  (1 unrouted)
TXOUT  (1 unrouted)
USB+  (1 unrouted)
USB-  (1 unrouted)
VBIAS  (3 unrouted)
VCC  (21 unrouted)
VPP  (3 unrouted)

### Text on the board
Bottom: USB | RADIO
tPlace: PWR | http://www.gmskhotspot.com | PTT | LOW | NQSMHS V2 | NI2O 02/2011 | MED | HIGH | DCOS | COS | DCOS | Low | Medium | High | RX | TX
tNames: Serial #